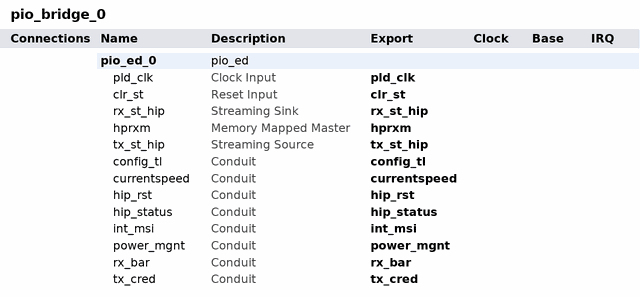
[diagram p0: system contents]
# Platform Designer (Qsys) system pio_bridge_0, Arria 10 10AX066H2F34E2SG
# Parameters at their usual value, and those the tool derives, are not listed.
package require qsys
create_system pio_bridge_0
set_project_property DEVICE_FAMILY {Arria 10}
set_project_property DEVICE 10AX066H2F34E2SG

add_instance pio_ed_0 pio_ed 25.1
set_instance_property pio_ed_0 AUTO_EXPORT true
set_instance_parameter_value pio_ed_0 DBUS_WIDTH 128
set_instance_parameter_value pio_ed_0 pcie_qsys 1

# exported interfaces
add_interface clr_st reset sink
set_interface_property clr_st EXPORT_OF pio_ed_0.clr_st
add_interface config_tl conduit end
set_interface_property config_tl EXPORT_OF pio_ed_0.config_tl
add_interface currentspeed conduit end
set_interface_property currentspeed EXPORT_OF pio_ed_0.currentspeed
add_interface hip_rst conduit end
set_interface_property hip_rst EXPORT_OF pio_ed_0.hip_rst
add_interface hip_status conduit end
set_interface_property hip_status EXPORT_OF pio_ed_0.hip_status
add_interface hprxm avalon master
set_interface_property hprxm EXPORT_OF pio_ed_0.hprxm
add_interface int_msi conduit end
set_interface_property int_msi EXPORT_OF pio_ed_0.int_msi
add_interface pld_clk clock sink
set_interface_property pld_clk EXPORT_OF pio_ed_0.pld_clk
add_interface power_mgnt conduit end
set_interface_property power_mgnt EXPORT_OF pio_ed_0.power_mgnt
add_interface rx_bar conduit end
set_interface_property rx_bar EXPORT_OF pio_ed_0.rx_bar
add_interface rx_st_hip avalon_streaming sink
set_interface_property rx_st_hip EXPORT_OF pio_ed_0.rx_st_hip
add_interface tx_cred conduit end
set_interface_property tx_cred EXPORT_OF pio_ed_0.tx_cred
add_interface tx_st_hip avalon_streaming source
set_interface_property tx_st_hip EXPORT_OF pio_ed_0.tx_st_hip

set_interconnect_requirement {$system} qsys_mm.clockCrossingAdapter HANDSHAKE
set_interconnect_requirement {$system} qsys_mm.enableEccProtection FALSE
set_interconnect_requirement {$system} qsys_mm.insertDefaultSlave FALSE
set_interconnect_requirement {$system} qsys_mm.maxAdditionalLatency 1

save_system pio_bridge_0.qsys
